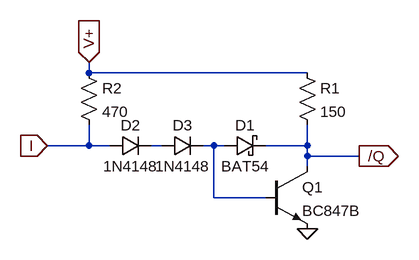
[diagram p0: schematic INV.asc]
INV.asc, the LTspice schematic file:
Version 4
SHEET 1 880 680
WIRE 16 64 16 48
WIRE 352 64 16 64
WIRE 16 176 16 144
WIRE 16 176 -48 176
WIRE 48 176 16 176
WIRE 128 176 112 176
WIRE 208 176 192 176
WIRE 224 176 208 176
WIRE 352 176 352 144
WIRE 352 176 288 176
WIRE 352 192 352 176
WIRE 432 192 352 192
WIRE 352 208 352 192
WIRE 208 256 208 176
WIRE 288 256 208 256
FLAG 352 304 0
FLAG 432 192 /Q
IOPIN 432 192 Out
FLAG 16 48 V+
IOPIN 16 48 In
FLAG -48 176 I
IOPIN -48 176 In
SYMBOL npn 288 208 R0
SYMATTR InstName Q1
SYMATTR Value BC847B
SYMBOL res 336 48 R0
SYMATTR InstName R1
SYMATTR Value 150
SYMBOL res 0 48 R0
SYMATTR InstName R2
SYMATTR Value 470
SYMBOL schottky 224 192 R270
WINDOW 0 32 32 VTop 2
WINDOW 3 0 32 VBottom 2
SYMATTR InstName D1
SYMATTR Value BAT54
SYMATTR Description Diode
SYMATTR Type diode
SYMBOL diode 48 160 M90
WINDOW 0 0 32 VBottom 2
WINDOW 3 32 32 VTop 2
SYMATTR InstName D2
SYMATTR Value 1N4148
SYMBOL diode 128 160 M90
WINDOW 0 0 32 VBottom 2
WINDOW 3 32 32 VTop 2
SYMATTR InstName D3
SYMATTR Value 1N4148

The netlist it stands for:
* INV.asc
Q1 /Q N002 0 0 BC847B
R1 V+ /Q 150
R2 V+ I 470
D1 N002 /Q BAT54
D2 I N001 1N4148
D3 N001 N002 1N4148
.model D D
.lib standard.dio
.model NPN NPN
.model PNP PNP
.lib standard.bjt
.backanno
.end